# EAGLE design untitled (EAGLE 6.1)
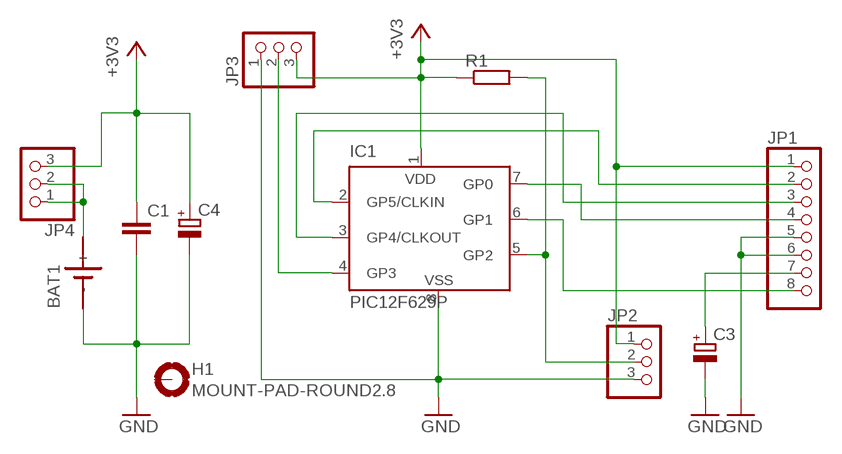
[diagram p0: schematic, sheet 1]

## Parts
BAT1  SN2032  [SN2032]
C1  C-EU025-025X050  [C025-025X050]
C3  CPOL-EUTT2D5L  [TT2D5L]
C4  CPOL-EUTT2D5L  [TT2D5L]
H1  MOUNT-PAD-ROUND2.8  [2,8-PAD]
IC1  PIC12F629P  [DIL8]
JP1  PINHD-1X8  [1X08]
JP2  PINHD-1X3  [1X03]
JP3  PINHD-1X3  [1X03]
JP4  PINHD-1X3  [1X03]
R1  R-EU_0204/2V  [0204V]

## Nets
+3V3: C1.1 C4.+ IC1.1(VDD) JP1.1 JP2.1 JP3.3 JP4.3 R1.1
GND: BAT1.- C1.2 C3.- C4.- IC1.8(VSS) JP1.5 JP1.6 JP2.3 JP3.1
N$1: IC1.6(GP1) JP1.8
N$2: IC1.7(GP0) JP1.4
N$3: IC1.2(GP5/CLKIN) JP1.2
N$4: IC1.3(GP4/CLKOUT) JP1.3
N$5: IC1.4(GP3) JP3.2
N$6: BAT1.+ JP4.1 JP4.2
N$7: C3.+ JP1.7
N$9: IC1.5(GP2) JP2.2 R1.2
Unconnected: H1.B2,8(MOUNT)

## Library data of the parts
BAT1 = sn2032:SN2032: LI BATTERY
C1 = rcl:C-EU: CAPACITOR, European symbol
C3 C4 = rcl:CPOL-EU: POLARIZED CAPACITOR, European symbol
H1 = holes:MOUNT-PAD-ROUND: MOUNTING PAD, round
IC1 = microchip:PIC12F6*: Data Sheet 8-Pin FLASH-Based 8-Bit CMOS Microcontrollers Source: http://www.microchip.com .. 41190c.pdf; MF: MICROCHIP; MPN: PIC12F629-I/P; OC_FARNELL: 1292253; OC_NEWARK: 67K0822
JP1 = pinhead:PINHD-1X8: PIN HEADER
JP2-JP4 = pinhead:PINHD-1X3: PIN HEADER
R1 = rcl:R-EU_: RESISTOR, European symbol

## Board
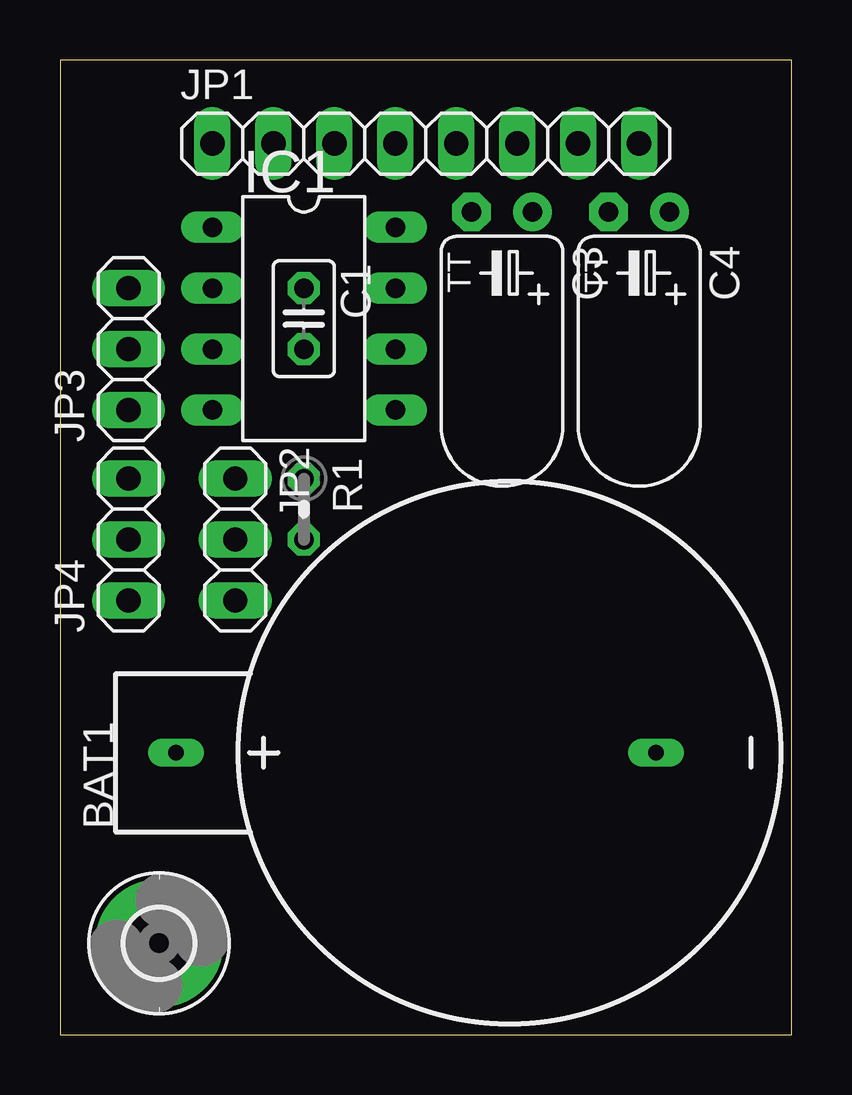
[diagram p1: board, top side]
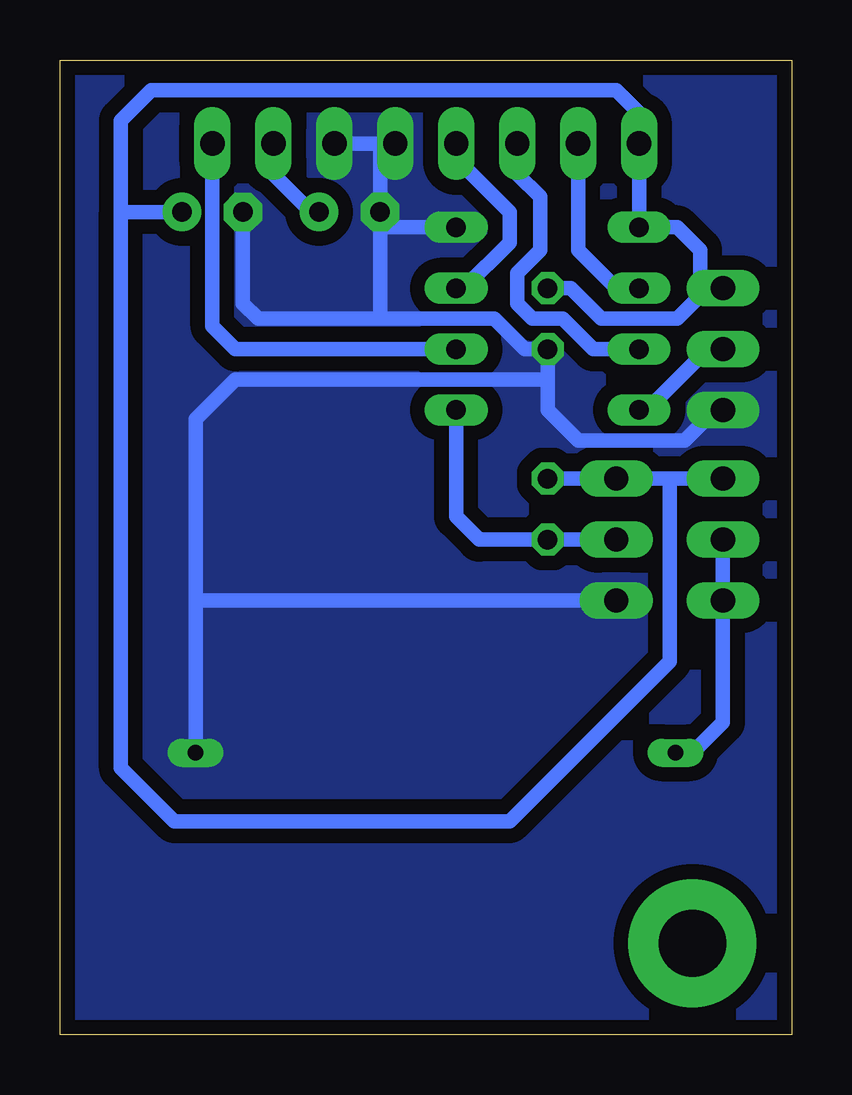
[diagram p2: board, bottom side, seen from below]

Size 30.48 x 40.63 mm. Coordinates in mm from the lower left corner, seen from the top.
Outline: 0,0 30.48,0 30.48,40.63 0,40.63 0,0
Copper layers (1*16): Top 0.035mm / dielectric 1.5mm / Bottom 0.035mm
Design rules: minimum track width 10mil, minimum drill 24mil, track to track 12mil, track to pad 12mil, pad to pad 12mil, via to via 12mil, smd to smd 10mil, copper to edge 12mil, drill to drill 12mil, minimum pad ring 10mil, minimum via ring 10mil, stop-mask expansion 4mil, vias tented up to drill 0mil, thermal gap 12mil

### Footprints (pad centres in the part's own frame; a part is rotated, then mirrored left to right if it is on the bottom)
SN2032 = drill 0.65 long: + 0,13.9; - 0,-6.1
C025-025X050 = drill 0.813 octagon: 1 -1.27,0; 2 1.27,0
TT2D5L = drill 0.813 pad 1.6: + -1.27,0 | drill 0.813 pad 1.6 octagon: - 1.27,0
2,8-PAD = drill 2.8 pad 5.334: B2,8 0,0
DIL8 = drill 0.813 long: 1 -3.81,-3.81; 2 -1.27,-3.81; 3 1.27,-3.81; 4 3.81,-3.81; 5 3.81,3.81; 6 1.27,3.81; 7 -1.27,3.81; 8 -3.81,3.81
1X08 = drill 1.016 long: 1 -8.89,0; 2 -6.35,0; 3 -3.81,0; 4 -1.27,0; 5 1.27,0; 6 3.81,0; 7 6.35,0; 8 8.89,0
1X03 = drill 1.016 long: 1 -2.54,0; 2 0,0; 3 2.54,0
0204V = drill 0.813 octagon: 1 -1.27,0; 2 1.27,0

### Placement (x,y rotation side)
BAT1  18.73,11.75 90 top
C1  10.16,29.84 270 top
C3  18.41,34.29 180 top
C4  24.13,34.29 180 top
H1  4.13,3.81 0 top
IC1  10.16,29.84 270 top
JP1  15.24,37.15 0 top
JP2  7.3,20.64 270 top
JP3  2.86,28.57 90 top
JP4  2.86,20.64 90 top
R1  10.16,21.91 270 top

### Tracks (layer width: path | path; a pad name or v marks a point on that pad's centre or on a via)
+3V3
  Bottom 0.61: C1.1 9.21,31.11 7.94,29.84 4.76,29.84 3.81,30.8 3.81,31.11 | 27.94,34.29 27.94,38.1 26.67,39.37 7.3,39.37 6.35,38.42 JP1.1 IC1.1 4.76,33.66 3.81,32.7 3.81,31.11 | C4.+ 27.94,34.29 | R1.1 JP2.1 5.08,23.18 | JP4.3 5.08,23.18 | JP3.3 3.81,31.11 | 5.08,23.18 5.08,15.56 11.75,8.89 25.72,8.89 27.94,11.11 27.94,34.29
GND
  Bottom 0.61: 17.14,33.66 C3.- 17.14,37.15 | IC1.8 17.14,33.66 | 17.14,37.15 JP1.5 | JP1.6 17.14,37.15 | 22.23,18.1 JP2.3 24.83,18.1 | JP3.1 3.17,26.04 4.45,24.77 8.89,24.77 10.16,26.04 10.16,27.3 | 17.14,29.84 12.38,29.84 11.11,28.57 C1.2 10.16,27.3 | 17.14,29.84 22.23,29.84 22.86,30.48 C4.- | 17.14,33.66 17.14,29.84 | BAT1.- 24.83,18.1 | 24.83,18.1 24.83,25.65 23.18,27.3 10.16,27.3
  pour Bottom (isolate 0.61, no thermals): 0,0 30.48,0 30.48,40.64 0,40.64
N$1
  Bottom 0.61: IC1.6 23.18,28.57 24.13,29.53 JP1.8
N$2
  Bottom 0.61: JP1.4 13.97,36.51 11.75,34.29 11.75,33.02 13.65,31.11 IC1.7
N$3
  Bottom 0.61: IC1.2 7.3,31.11 8.89,32.7 JP1.2
N$4
  Bottom 0.61: IC1.3 8.26,28.57 9.53,29.84 10.79,29.84 11.43,30.48 11.43,31.75 10.48,32.7 10.48,34.92 11.43,35.88 JP1.3
N$5
  Bottom 0.61: JP3.2 3.49,28.57 6.03,26.04 IC1.4
N$6
  Bottom 0.61: JP4.2 JP4.1 2.86,13.02 4.13,11.75 BAT1.+
N$7
  Bottom 0.61: C3.+ 20,34.29 21.59,35.88 JP1.7
N$9
  Bottom 0.61: JP2.2 R1.2 13.02,20.64 13.97,21.59 IC1.5